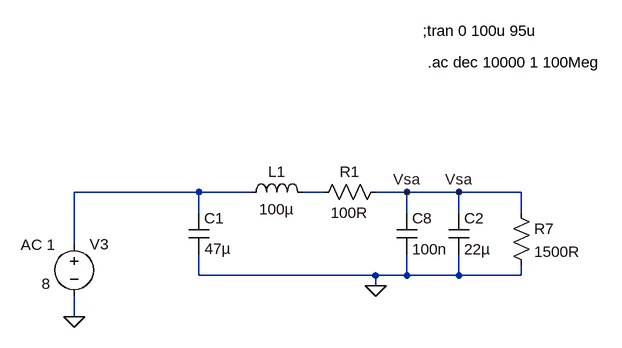
[diagram p0: schematic SA612 Power Supply Decoupling Test.asc]
SA612 Power Supply Decoupling Test.asc, the LTspice schematic file:
Version 4
SHEET 1 1176 1300
WIRE -512 208 -704 208
WIRE -432 208 -512 208
WIRE -320 208 -352 208
WIRE -192 208 -240 208
WIRE -112 208 -192 208
WIRE -16 208 -112 208
WIRE -512 240 -512 208
WIRE -192 240 -192 208
WIRE -112 240 -112 208
WIRE -16 240 -16 208
WIRE -704 288 -704 208
WIRE -512 336 -512 304
WIRE -240 336 -512 336
WIRE -192 336 -192 304
WIRE -192 336 -240 336
WIRE -112 336 -112 304
WIRE -112 336 -192 336
WIRE -16 336 -16 320
WIRE -16 336 -112 336
WIRE -240 352 -240 336
WIRE -704 400 -704 368
FLAG -704 400 0
FLAG -240 352 0
FLAG -192 208 Vsa
FLAG -112 208 Vsa
SYMBOL voltage -704 272 R0
WINDOW 3 -50 77 Left 2
WINDOW 123 -82 17 Left 2
WINDOW 39 0 0 Left 2
SYMATTR Value 8
SYMATTR Value2 AC 1
SYMATTR InstName V3
SYMBOL ind -448 224 R270
WINDOW 0 32 56 VTop 2
WINDOW 3 5 56 VBottom 2
SYMATTR InstName L1
SYMATTR Value 100µ
SYMBOL cap -208 240 R0
SYMATTR InstName C8
SYMATTR Value 100n
SYMBOL res -32 224 R0
SYMATTR InstName R7
SYMATTR Value 1500R
SYMBOL cap -528 240 R0
WINDOW 3 25 55 Left 2
SYMATTR Value 47µ
SYMATTR InstName C1
SYMBOL res -224 192 R90
WINDOW 0 0 56 VBottom 2
WINDOW 3 32 56 VTop 2
SYMATTR InstName R1
SYMATTR Value 100R
SYMBOL cap -128 240 R0
SYMATTR InstName C2
SYMATTR Value 22µ
TEXT -168 -40 Left 2 !;tran 0 100u 95u
TEXT -160 8 Left 2 !.ac dec 10000 1 100Meg

The netlist it stands for:
* SA612 Power Supply Decoupling Test.asc
V3 N001 0 8 AC 1
L1 N001 N002 100µ
C8 Vsa 0 100n
R7 Vsa 0 1500R
C1 N001 0 47µ
R1 Vsa N002 100R
C2 Vsa 0 22µ
;tran 0 100u 95u
.ac dec 10000 1 100Meg
.backanno
.end